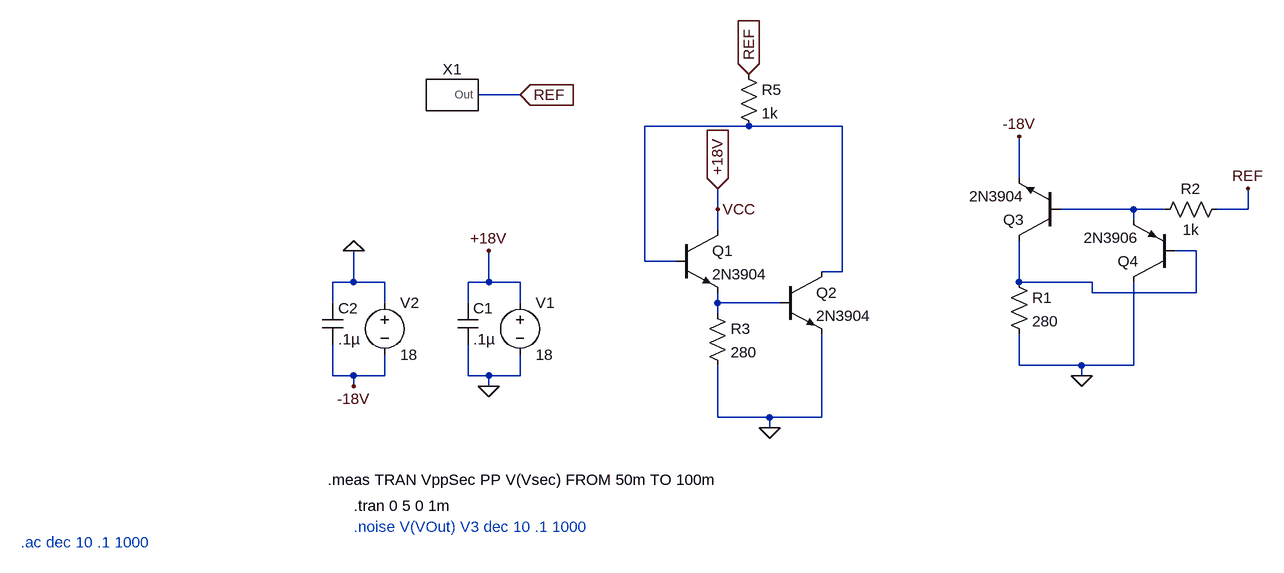
[diagram p0: schematic CurrentLimiter.asc]
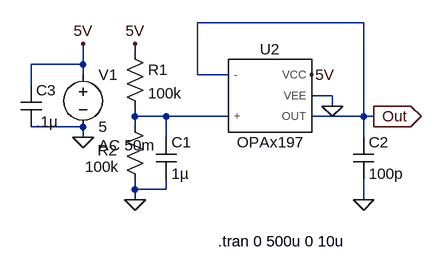
[diagram p1: sub-circuit refamp197.asc]
CurrentLimiter.asc, the LTspice schematic file:
Version 4
SHEET 1 1300 680
WIRE 48 -32 -16 -32
WIRE 400 16 240 16
WIRE 544 16 400 16
WIRE 816 96 816 32
WIRE 352 144 352 112
WIRE 992 144 880 144
WIRE 1040 144 992 144
WIRE 1168 144 1168 112
WIRE 1168 144 1120 144
WIRE 992 160 992 144
WIRE 352 176 352 144
WIRE 1088 208 1056 208
WIRE 240 224 240 16
WIRE 288 224 240 224
WIRE 544 240 544 16
WIRE 544 240 512 240
WIRE -208 256 -208 208
WIRE -208 256 -240 256
WIRE -160 256 -208 256
WIRE 0 256 0 208
WIRE 0 256 -32 256
WIRE 48 256 0 256
WIRE 816 256 816 192
WIRE 928 256 816 256
WIRE 928 272 928 256
WIRE 1088 272 1088 208
WIRE 1088 272 928 272
WIRE -240 288 -240 256
WIRE -160 288 -160 256
WIRE -32 288 -32 256
WIRE 48 288 48 256
WIRE 352 288 352 272
WIRE 448 288 352 288
WIRE 352 304 352 288
WIRE 816 384 816 336
WIRE 912 384 816 384
WIRE 992 384 992 256
WIRE 992 384 912 384
WIRE -240 400 -240 352
WIRE -208 400 -240 400
WIRE -160 400 -160 368
WIRE -160 400 -208 400
WIRE -32 400 -32 352
WIRE 0 400 -32 400
WIRE 48 400 48 368
WIRE 48 400 0 400
WIRE 912 400 912 384
WIRE -208 416 -208 400
WIRE 0 416 0 400
WIRE 352 464 352 384
WIRE 432 464 352 464
WIRE 512 464 512 336
WIRE 512 464 432 464
WIRE 432 480 432 464
FLAG 432 480 0
FLAG 400 -64 REF
IOPIN 400 -64 In
FLAG 352 112 +18V
IOPIN 352 112 In
FLAG 48 -32 REF
IOPIN 48 -32 In
FLAG 0 416 0
FLAG 0 208 +18V
FLAG 352 144 VCC
FLAG -208 416 -18V
FLAG -208 208 0
FLAG 816 32 -18V
FLAG 912 400 0
FLAG 1168 112 REF
SYMBOL res 336 288 R0
SYMATTR InstName R3
SYMATTR Value 280
SYMBOL npn 288 176 R0
SYMATTR InstName Q1
SYMATTR Value 2N3904
SYMBOL npn 448 240 R0
SYMATTR InstName Q2
SYMATTR Value 2N3904
SYMBOL refamp197 -64 -32 R0
SYMATTR InstName X1
SYMBOL res 384 -80 R0
SYMATTR InstName R5
SYMATTR Value 1k
SYMBOL voltage 48 272 R0
WINDOW 123 0 0 Left 0
WINDOW 39 0 0 Left 0
SYMATTR InstName V1
SYMATTR Value 18
SYMBOL cap -48 288 R0
SYMATTR InstName C1
SYMATTR Value .1µ
SYMBOL voltage -160 272 R0
WINDOW 123 0 0 Left 0
WINDOW 39 0 0 Left 0
SYMATTR InstName V2
SYMATTR Value 18
SYMBOL cap -256 288 R0
SYMATTR InstName C2
SYMATTR Value .1µ
SYMBOL npn 880 192 R180
SYMATTR InstName Q3
SYMATTR Value 2N3904
SYMBOL res 800 240 R0
SYMATTR InstName R1
SYMATTR Value 280
SYMBOL pnp 1056 256 R180
SYMATTR InstName Q4
SYMATTR Value 2N3906
SYMBOL res 1136 128 R90
WINDOW 0 0 56 VBottom 2
WINDOW 3 32 56 VTop 2
SYMATTR InstName R2
SYMATTR Value 1k
TEXT -208 600 Left 2 !.tran 0 5 0 1m
TEXT -208 632 Left 2 ;.noise V(VOut) V3 dec 10 .1 1000
TEXT -248 560 Left 2 !.meas TRAN VppSec PP V(Vsec) FROM 50m TO 100m
TEXT -720 656 Left 2 ;.ac dec 10 .1 1000

refamp197.asc, the sub-circuit schematic file:
Version 4
SHEET 1 880 680
WIRE 432 64 176 64
WIRE 80 112 80 96
WIRE 0 128 0 96
WIRE 0 128 -80 128
WIRE 0 144 0 128
WIRE 176 144 176 64
WIRE 224 144 176 144
WIRE -80 160 -80 128
WIRE 384 176 352 176
WIRE 384 192 384 176
WIRE 80 208 80 192
WIRE 128 208 80 208
WIRE 224 208 128 208
WIRE 432 208 432 64
WIRE 432 208 352 208
WIRE 448 208 432 208
WIRE 0 224 -80 224
WIRE 80 224 80 208
WIRE 0 240 0 224
WIRE 128 240 128 208
WIRE 432 240 432 208
WIRE 80 320 80 304
WIRE 128 320 128 304
WIRE 128 320 80 320
WIRE 80 336 80 320
WIRE 432 336 432 304
FLAG 80 336 0
FLAG 0 240 0
FLAG 0 96 5V
FLAG 80 96 5V
FLAG 352 144 5V
FLAG 432 336 0
FLAG 384 192 0
FLAG 448 208 Out
IOPIN 448 208 Out
SYMBOL voltage 0 128 R0
WINDOW 123 24 124 Left 2
WINDOW 39 0 0 Left 0
SYMATTR Value2 AC 50m
SYMATTR InstName V1
SYMATTR Value 5
SYMBOL res 64 96 R0
SYMATTR InstName R1
SYMATTR Value 100k
SYMBOL res 64 208 R0
WINDOW 0 -42 52 Left 2
WINDOW 3 -61 77 Left 2
SYMATTR InstName R2
SYMATTR Value 100k
SYMBOL cap 112 240 R0
SYMATTR InstName C1
SYMATTR Value 1µ
SYMBOL cap 416 240 R0
SYMATTR InstName C2
SYMATTR Value 100p
SYMBOL cap -96 160 R0
SYMATTR InstName C3
SYMATTR Value .1µ
SYMBOL OPAx197 288 176 R0
SYMATTR InstName U2
TEXT 208 400 Left 2 !.tran 0 500u 0 10u

The netlist it stands for:
* CurrentLimiter.asc
R3 N004 0 280
Q1 VCC N001 N004 0 2N3904
Q2 N001 N004 0 0 2N3904
XX1 REF refamp197
R5 REF N001 1k
V1 VCC 0 18
C1 VCC 0 .1µ
V2 0 -18V 18
C2 0 -18V .1µ
Q3 N003 N002 -18V 0 2N3904
R1 N003 0 280
Q4 0 N003 N002 0 2N3906
R2 REF N002 1k

* block symbol definitions
.subckt refamp197 Out
V1 5V 0 5 AC 50m
R1 5V N001 100k
R2 N001 0 100k
C1 N001 0 1µ
C2 Out 0 100p
C3 5V 0 .1µ
XU2 N001 Out 5V 0 Out OPAx197  ; pins + - VCC VEE OUT
.tran 0 500u 0 10u
.ends refamp197

.model NPN NPN
.model PNP PNP
.lib standard.bjt
.tran 0 5 0 1m
* .noise V(VOut) V3 dec 10 .1 1000
.meas TRAN VppSec PP V(Vsec) FROM 50m TO 100m
* .ac dec 10 .1 1000
.lib C:\Users\bismi\OneDrive\Documents\LTspice\SPICEV2\OPAx197.LIB
.backanno
.end